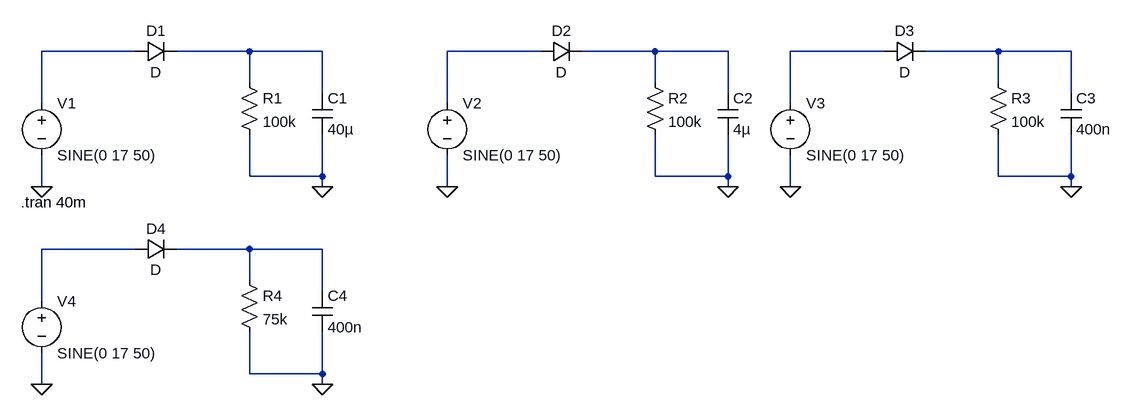
[diagram p0: schematic Simu ej#7.asc]
Simu ej#7.asc, the LTspice schematic file:
Version 4
SHEET 1 1736 680
WIRE 80 64 -64 64
WIRE 256 64 144 64
WIRE 368 64 256 64
WIRE 704 64 560 64
WIRE 880 64 768 64
WIRE 992 64 880 64
WIRE 1232 64 1088 64
WIRE 1408 64 1296 64
WIRE 1520 64 1408 64
WIRE 256 112 256 64
WIRE 880 112 880 64
WIRE 1408 112 1408 64
WIRE 368 128 368 64
WIRE 992 128 992 64
WIRE 1520 128 1520 64
WIRE -64 144 -64 64
WIRE 560 144 560 64
WIRE 1088 144 1088 64
WIRE 256 256 256 192
WIRE 368 256 368 192
WIRE 368 256 256 256
WIRE 880 256 880 192
WIRE 992 256 992 192
WIRE 992 256 880 256
WIRE 1408 256 1408 192
WIRE 1520 256 1520 192
WIRE 1520 256 1408 256
WIRE -64 272 -64 224
WIRE 368 272 368 256
WIRE 560 272 560 224
WIRE 992 272 992 256
WIRE 1088 272 1088 224
WIRE 1520 272 1520 256
WIRE 80 368 -64 368
WIRE 256 368 144 368
WIRE 368 368 256 368
WIRE 256 416 256 368
WIRE 368 432 368 368
WIRE -64 448 -64 368
WIRE 256 560 256 496
WIRE 368 560 368 496
WIRE 368 560 256 560
WIRE -64 576 -64 528
WIRE 368 576 368 560
FLAG 368 272 0
FLAG -64 272 0
FLAG 992 272 0
FLAG 560 272 0
FLAG 1520 272 0
FLAG 1088 272 0
FLAG 368 576 0
FLAG -64 576 0
SYMBOL voltage -64 128 R0
WINDOW 123 0 0 Left 0
WINDOW 39 0 0 Left 0
SYMATTR InstName V1
SYMATTR Value SINE(0 17 50)
SYMBOL diode 80 80 R270
WINDOW 0 32 32 VTop 2
WINDOW 3 0 32 VBottom 2
SYMATTR InstName D1
SYMBOL res 240 96 R0
SYMATTR InstName R1
SYMATTR Value 100k
SYMBOL cap 352 128 R0
SYMATTR InstName C1
SYMATTR Value 40µ
SYMBOL voltage 560 128 R0
WINDOW 123 0 0 Left 0
WINDOW 39 0 0 Left 0
SYMATTR InstName V2
SYMATTR Value SINE(0 17 50)
SYMBOL diode 704 80 R270
WINDOW 0 32 32 VTop 2
WINDOW 3 0 32 VBottom 2
SYMATTR InstName D2
SYMBOL res 864 96 R0
SYMATTR InstName R2
SYMATTR Value 100k
SYMBOL cap 976 128 R0
SYMATTR InstName C2
SYMATTR Value 4µ
SYMBOL voltage 1088 128 R0
WINDOW 123 0 0 Left 0
WINDOW 39 0 0 Left 0
SYMATTR InstName V3
SYMATTR Value SINE(0 17 50)
SYMBOL diode 1232 80 R270
WINDOW 0 32 32 VTop 2
WINDOW 3 0 32 VBottom 2
SYMATTR InstName D3
SYMBOL res 1392 96 R0
SYMATTR InstName R3
SYMATTR Value 100k
SYMBOL cap 1504 128 R0
SYMATTR InstName C3
SYMATTR Value 400n
SYMBOL diode 80 384 R270
WINDOW 0 32 32 VTop 2
WINDOW 3 0 32 VBottom 2
SYMATTR InstName D4
SYMBOL res 240 400 R0
SYMATTR InstName R4
SYMATTR Value 75k
SYMBOL cap 352 432 R0
SYMATTR InstName C4
SYMATTR Value 400n
SYMBOL voltage -64 432 R0
WINDOW 123 0 0 Left 0
WINDOW 39 0 0 Left 0
SYMATTR InstName V4
SYMATTR Value SINE(0 17 50)
TEXT -96 296 Left 2 !.tran 40m

The netlist it stands for:
* Simu ej#7.asc
V1 N001 0 SINE(0 17 50)
D1 N001 N002 D
R1 N002 0 100k
C1 N002 0 40µ
V2 N003 0 SINE(0 17 50)
D2 N003 N004 D
R2 N004 0 100k
C2 N004 0 4µ
V3 N005 0 SINE(0 17 50)
D3 N005 N006 D
R3 N006 0 100k
C3 N006 0 400n
D4 N007 N008 D
R4 N008 0 75k
C4 N008 0 400n
V4 N007 0 SINE(0 17 50)
.model D D
.lib standard.dio
.tran 40m
.backanno
.end